# Altium schematic sheet Main.SchDoc
size A
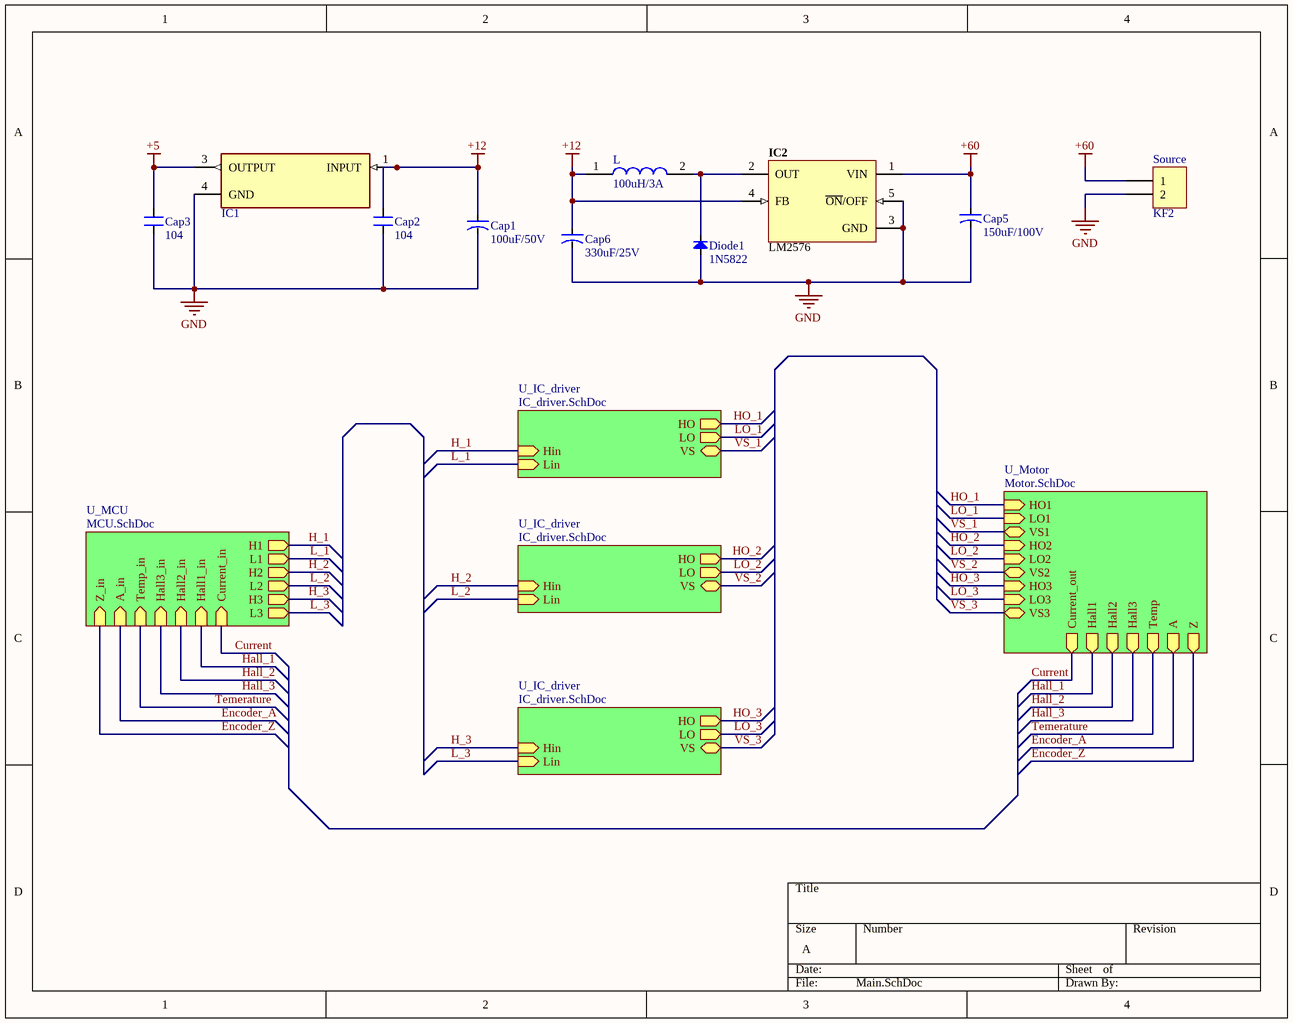
[diagram p0: Main.SchDoc]

## Parts
Cap1  100uF/50V  [CAP FILM 1206]
Cap2  104  [CAP FILM 0603_1608]
Cap3  104  [CAP FILM 0603_1608]
Cap5  150uF/100V  [CAP TH ALUM ELEC D10.00mm S5.00mm H20.00mm]
Cap6  330uF/25V  [CAP-ALU-SMD-F]
Diode1  1N5822  [DIO-SMD-B]
IC1  L7805CD2T-TR  [STMicroelectronics_D²PAK_0079457_22_MFG]  (value not drawn)
IC2  LM2576  [TO263]
L  100uH/3A  [INDPM102100X400N]
Source  KF2  [KF2-5.08]

## Sub-sheets
U_IC_driver = IC_driver.SchDoc: HO (out), LO (out), VS (bidir), Hin (in), Lin (in)
U_IC_driver = IC_driver.SchDoc: HO (out), LO (out), VS (bidir), Hin (in), Lin (in)
U_IC_driver = IC_driver.SchDoc: HO (out), LO (out), VS (bidir), Hin (in), Lin (in)
U_MCU = MCU.SchDoc: H1 (out), L1 (out), H2 (out), L2 (out), H3 (out), L3 (out), Current_in (in), Hall1_in (in), Hall2_in (in), Hall3_in (in), Temp_in (in), A_in (in), Z_in (in)
U_Motor = Motor.SchDoc: HO1 (in), LO1 (in), VS1 (bidir), HO2 (in), LO2 (in), VS2 (bidir), HO3 (in), LO3 (in), VS3 (bidir), Current_out (out), Hall2 (out), Hall3 (out), Hall1 (out), Temp (out), A (out), Z (out)

## Nets
+5: Cap3.2 IC1.3(OUTPUT)
+12: Cap1.1 Cap2.2 Cap6.1 IC1.1(INPUT) IC2.4(FB) L.1
+60: Cap5.1 IC2.1(VIN) Source.1
GND: Cap1.2 Cap2.1 Cap3.1 Cap5.2 Cap6.2 Diode1.1(A) IC1.4(GND) IC2.3(GND) IC2.5(~{ON}/OFF) Source.2
Current: sheet U_Motor/Current_out, sheet U_MCU/Current_in
Encoder_A: sheet U_Motor/A, sheet U_MCU/A_in
Encoder_Z: sheet U_Motor/Z, sheet U_MCU/Z_in
H_1: sheet U_IC_driver/Hin, sheet U_MCU/H1
H_2: sheet U_IC_driver/Hin, sheet U_MCU/H2
H_3: sheet U_IC_driver/Hin, sheet U_MCU/H3
Hall_1: sheet U_Motor/Hall1, sheet U_MCU/Hall1_in
Hall_2: sheet U_Motor/Hall2, sheet U_MCU/Hall2_in
Hall_3: sheet U_Motor/Hall3, sheet U_MCU/Hall3_in
HO_1: sheet U_IC_driver/HO, sheet U_Motor/HO1
HO_2: sheet U_IC_driver/HO, sheet U_Motor/HO2
HO_3: sheet U_IC_driver/HO, sheet U_Motor/HO3
L_1: sheet U_IC_driver/Lin, sheet U_MCU/L1
L_2: sheet U_IC_driver/Lin, sheet U_MCU/L2
L_3: sheet U_IC_driver/Lin, sheet U_MCU/L3
LO_1: sheet U_IC_driver/LO, sheet U_Motor/LO1
LO_2: sheet U_IC_driver/LO, sheet U_Motor/LO2
LO_3: sheet U_IC_driver/LO, sheet U_Motor/LO3
Temerature: sheet U_Motor/Temp, sheet U_MCU/Temp_in
VS_1: sheet U_IC_driver/VS, sheet U_Motor/VS1
VS_2: sheet U_IC_driver/VS, sheet U_Motor/VS2
VS_3: sheet U_IC_driver/VS, sheet U_Motor/VS3
NetDiode1_2: Diode1.2(K) IC2.2(OUT) L.2

## Library data of the parts
Cap1 Cap5 Cap6 = CN-ALU-SMD: Polarized Capacitor (Axial); Published: 8-Jun-2000; LatestRevisionDate: 17-Jul-2002; LatestRevisionNote: Re-released for DXP Platform.; PackageReference: POLAR0.8; Publisher: Altium Limited
Cap2 Cap3 = CN2: Cap np 104 => 105pF; Value: 0.1uF
Diode1 = Diode SMD: Default Diode; Code - JEDEC: DO-214-AB; Value: 1N5007; Published: 8-Jun-2000; Revision: July-2002: Re-released for DXP Platform.; Publisher: Altium Limited
IC2 = LM2596: Max Input Voltage: 12 V; Max Output Current: 3 (6.0 peak) A; Max Output Voltage: mV; Category: IC-Power; Min Input Voltage: mV; Min Output Voltage: mV; Mounting Technology: Surface Mount; Status: Unreleased; Supply Voltage: mV; Temperature Range: -40 to +125 degC
L = CDRH104RNP-680NC: Inductor; Manufacturer_Name: Sumida; Datasheet Link: http://products.sumida.com/products/pdf/CDRH104,104R.pdf; Height: 4mm; Manufacturer_Part_Number: CDRH104RNP-680NC; Mouser Part Number: 851-CDRH104RNP-680NC; Mouser Price/Stock: https://www.mouser.co.uk/ProductDetail/Sumida/CDRH104RNP-680NC/?qs=b6HGhii3QUSW0bjw2331%2Fg%3D%3D; Arrow Part Number: CDRH104RNP-680NC; Arrow Price/Stock: https://www.arrow.com/en/products/cdrh104rnp-680nc/sumida
Source = KF2: Manufacturer: Würth Elektronik eiSos GmbH; partNo: 691103110002; ComponentLink1 Description: Manufacturer; ComponentLink2 Description: Datasheet; NoPins: 2; Created Date: 29 October 2013; ComponentLink1URL: http://www.we-online.com; ComponentLink2URL: http://katalog.we-online.de/em/datasheet/6911031100xx.pdf; Created by: Karrer Zheng